# EAGLE design vcf2 (EAGLE 7.2.0)
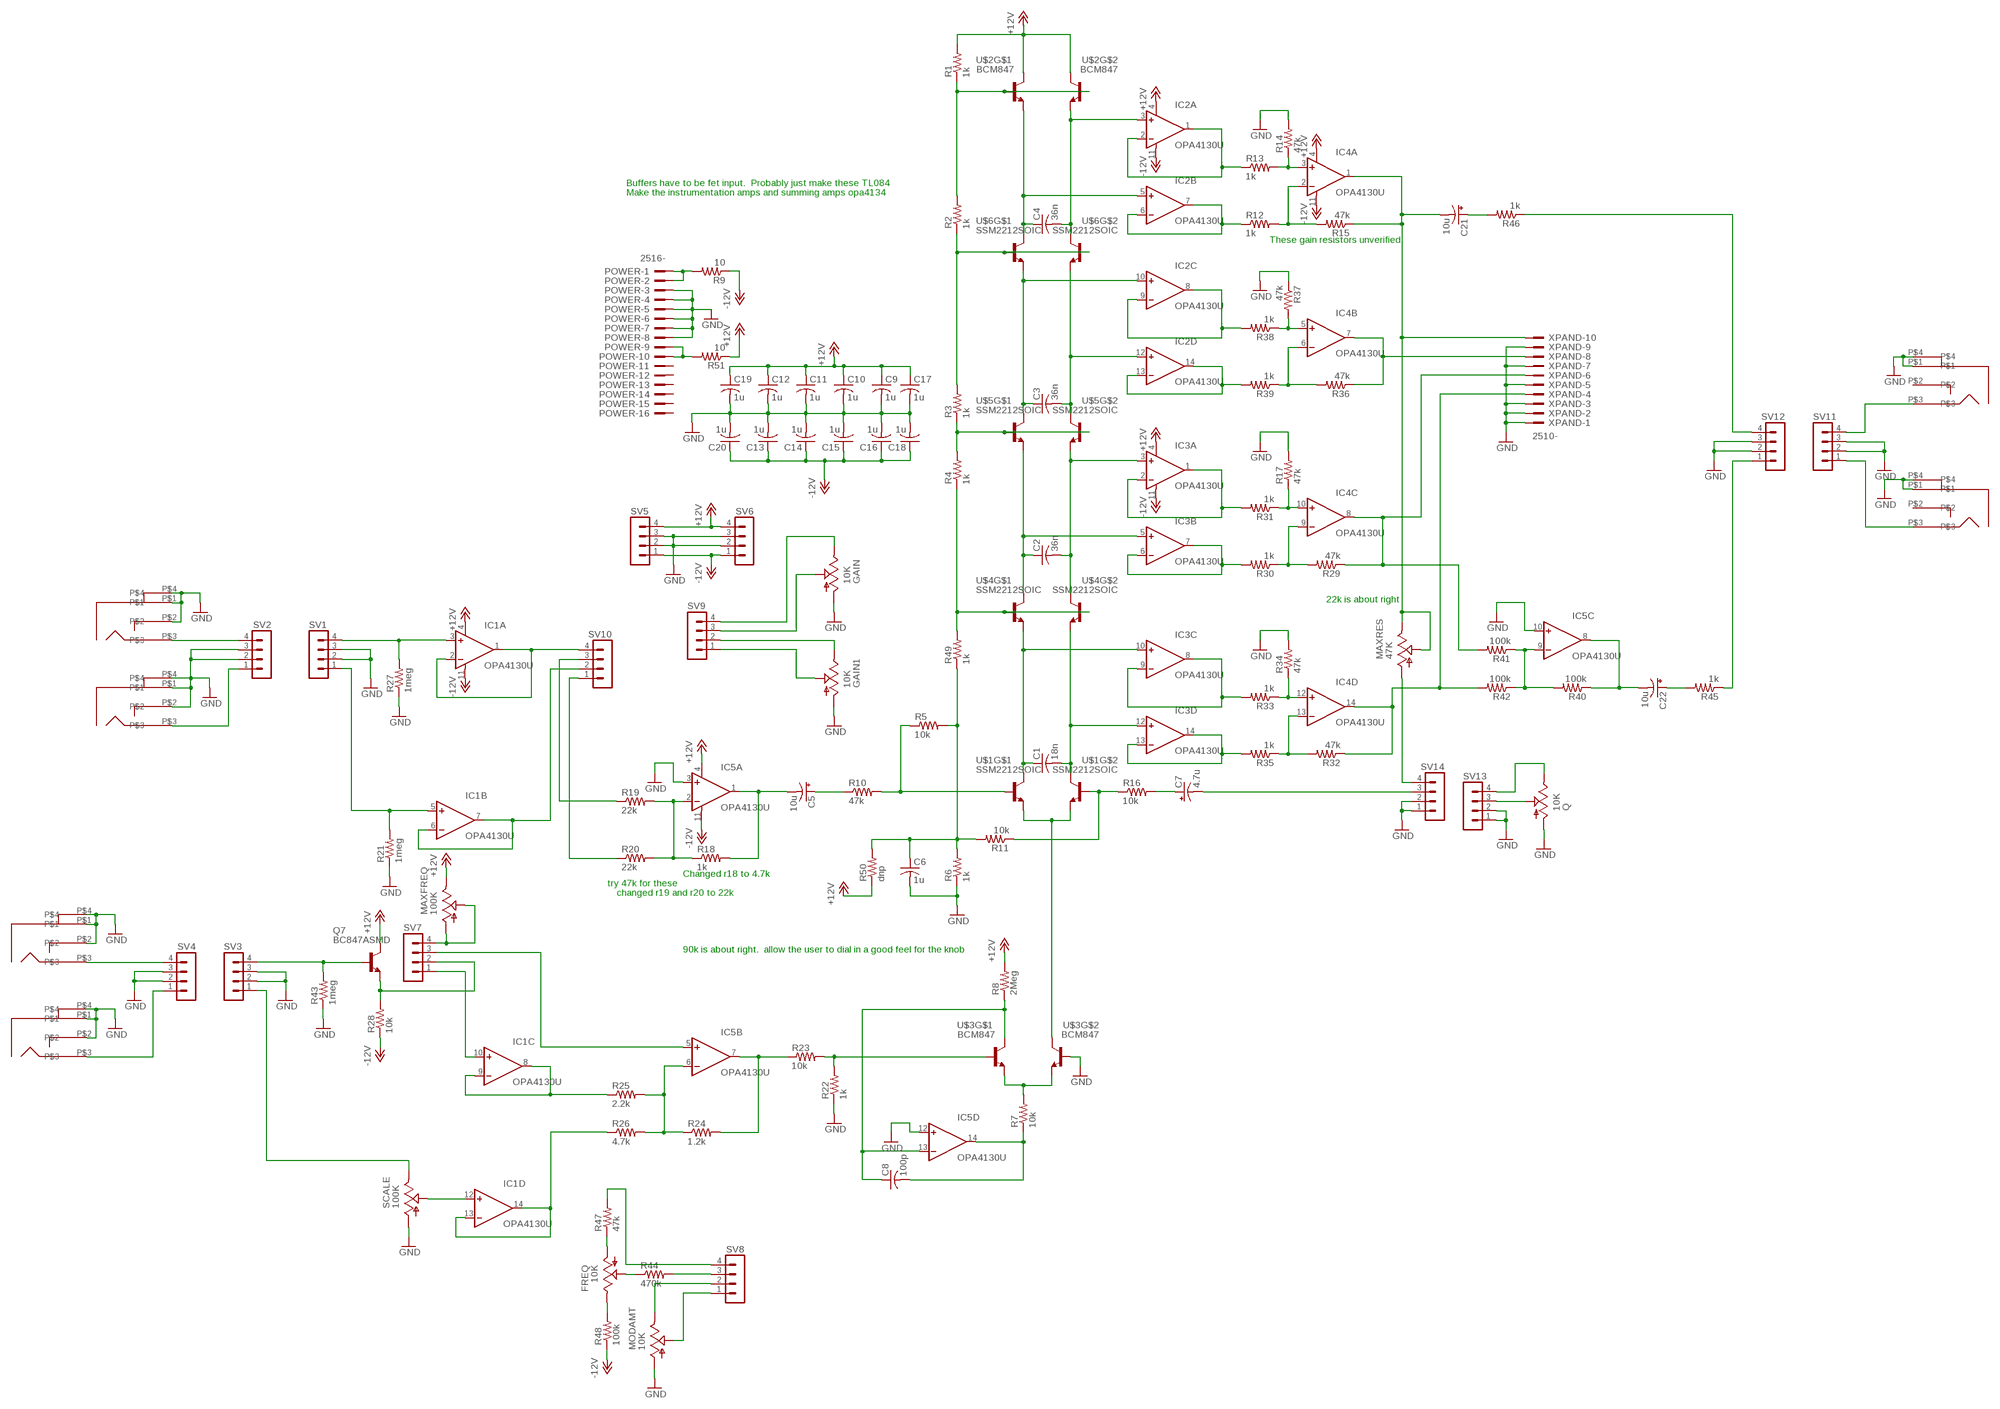
[diagram p0: schematic, sheet 1]

## Parts
AIN  PJ301BM  [PJ301BM]
AIN2  PJ301BM  [PJ301BM]
BP  PJ301BM  [PJ301BM]
C1  18n  C-USC0603  [C0603]
C2  36n  C-USC0603  [C0603]
C3  36n  C-USC0603  [C0603]
C4  36n  C-USC0603  [C0603]
C5  10u  CPOL-USE2.5-6  [E2,5-6]
C6  1u  C-USC0603  [C0603]
C7  4.7u  CPOL-USE2.5-6  [E2,5-6]
C8  100p  C-USC0603  [C0603]
C9  1u  C-USC0603  [C0603]
C10  1u  C-USC0603  [C0603]
C11  1u  C-USC0603  [C0603]
C12  1u  C-USC0603  [C0603]
C13  1u  C-USC0603  [C0603]
C14  1u  C-USC0603  [C0603]
C15  1u  C-USC0603  [C0603]
C16  1u  C-USC0603  [C0603]
C17  1u  C-USC0603  [C0603]
C18  1u  C-USC0603  [C0603]
C19  1u  C-USC0603  [C0603]
C20  1u  C-USC0603  [C0603]
C21  10u  CPOL-USE2.5-6  [E2,5-6]
C22  10u  CPOL-USE2.5-6  [E2,5-6]
FREQ  10K  US-EVUF2J  [EVUFXJ]
GAIN  10K  US-EVUF2J  [EVUFXJ]
GAIN1  10K  US-EVUF2J  [EVUFXJ]
IC1  OPA4130U  [SO14]
IC2  OPA4130U  [SO14]
IC3  OPA4130U  [SO14]
IC4  OPA4130U  [SO14]
IC5  OPA4130U  [SO14]
LP  PJ301BM  [PJ301BM]
MAXFREQ  100K  TRIM_US-S64W  [S64W]
MAXRES  47K  TRIM_US-S64W  [S64W]
MIN  PJ301BM  [PJ301BM]
MODAMT  10K  US-EVUF2J  [EVUFXJ]
POWER  2516-  [PAK100/2500-16]
Q  10K  US-EVUF2J  [EVUFXJ]
Q7  BC847ASMD  [SOT23]
R1  1k  R-US_R0603  [R0603]
R2  1k  R-US_R0603  [R0603]
R3  1k  R-US_R0603  [R0603]
R4  1k  R-US_R0603  [R0603]
R5  10k  R-US_R0603  [R0603]
R6  1k  R-US_R0603  [R0603]
R7  10k  R-US_R0603  [R0603]
R8  2Meg  R-US_R0603  [R0603]
R9  10  R-US_R0603  [R0603]
R10  47k  R-US_R0603  [R0603]
R11  10k  R-US_R0603  [R0603]
R12  1k  R-US_R0603  [R0603]
R13  1k  R-US_R0603  [R0603]
R14  47k  R-US_R0603  [R0603]
R15  47k  R-US_R0603  [R0603]
R16  10k  R-US_R0603  [R0603]
R17  47k  R-US_R0603  [R0603]
R18  1k  R-US_R0603  [R0603]
R19  22k  R-US_R0603  [R0603]
R20  22k  R-US_R0603  [R0603]
R21  1meg  R-US_R0603  [R0603]
R22  1k  R-US_R0603  [R0603]
R23  10k  R-US_R0603  [R0603]
R24  1.2k  R-US_R0603  [R0603]
R25  2.2k  R-US_R0603  [R0603]
R26  4.7k  R-US_R0603  [R0603]
R27  1meg  R-US_R0603  [R0603]
R28  10k  R-US_R0603  [R0603]
R29  47k  R-US_R0603  [R0603]
R30  1k  R-US_R0603  [R0603]
R31  1k  R-US_R0603  [R0603]
R32  47k  R-US_R0603  [R0603]
R33  1k  R-US_R0603  [R0603]
R34  47k  R-US_R0603  [R0603]
R35  1k  R-US_R0603  [R0603]
R36  47k  R-US_R0603  [R0603]
R37  47k  R-US_R0603  [R0603]
R38  1k  R-US_R0603  [R0603]
R39  1k  R-US_R0603  [R0603]
R40  100k  R-US_R0603  [R0603]
R41  100k  R-US_R0603  [R0603]
R42  100k  R-US_R0603  [R0603]
R43  1meg  R-US_R0603  [R0603]
R44  470k  R-US_R0603  [R0603]
R45  1k  R-US_R0603  [R0603]
R46  1k  R-US_R0603  [R0603]
R47  47k  R-US_R0603  [R0603]
R48  100k  R-US_R0603  [R0603]
R49  1k  R-US_R0603  [R0603]
R50  dnp  R-US_R0603  [R0603]
R51  10  R-US_R0603  [R0603]
SCALE  100K  TRIM_US-S64W  [S64W]
SV1  MA04-1  [MA04-1]
SV2  MA04-1  [MA04-1]
SV3  MA04-1  [MA04-1]
SV4  MA04-1  [MA04-1]
SV5  MA04-1  [MA04-1]
SV6  MA04-1  [MA04-1]
SV7  MA04-1  [MA04-1]
SV8  MA04-1  [MA04-1]
SV9  MA04-1  [MA04-1]
SV10  MA04-1  [MA04-1]
SV11  MA04-1  [MA04-1]
SV12  MA04-1  [MA04-1]
SV13  MA04-1  [MA04-1]
SV14  MA04-1  [MA04-1]
U$1  SSM2212SOIC  [SO08]
U$2  BCM847  [SOT457R_PHILIPS]
U$3  BCM847  [SOT457R_PHILIPS]
U$4  SSM2212SOIC  [SO08]
U$5  SSM2212SOIC  [SO08]
U$6  SSM2212SOIC  [SO08]
VPEROCT  PJ301BM  [PJ301BM]
XPAND  2510-  [PAK100/2500-10]

## Nets
+12V: C9.1 C10.1 C11.1 C12.1 C17.1 C19.1 IC1.4(A:V+) IC2.4(A:V+) IC3.4(A:V+) IC4.4(A:V+) IC5.4(A:V+) MAXFREQ.E Q7.3(C) R1.2 R8.2 R50.1 R51.1 SV5.4 SV6.4 U$2.3(C) U$2.6(C)
-12V: C13.1 C14.1 C15.1 C16.1 C18.1 C20.1 IC1.11(A:V-) IC2.11(A:V-) IC3.11(A:V-) IC4.11(A:V-) IC5.11(A:V-) R9.1 R28.1 R48.1 SV5.1 SV6.1
GND: AIN2.P$1 AIN2.P$2 AIN2.P$4 AIN.P$1 AIN.P$2 AIN.P$4 BP.P$1 BP.P$4 C6.2 C9.2 C10.2 C11.2 C12.2 C13.2 C14.2 C15.2 C16.2 C17.2 C18.2 C19.2 C20.2 GAIN1.1(A) GAIN.1(A) IC5.3(A:+IN) IC5.10(C:+IN) IC5.12(D:+IN) LP.P$1 LP.P$4 MIN.P$1 MIN.P$2 MIN.P$4 MODAMT.1(A) POWER.3 POWER.4 POWER.5 POWER.6 POWER.7 POWER.8 Q.1(A) R6.1 R14.2 R17.2 R21.1 R22.1 R27.1 R34.2 R37.1 R43.1 SCALE.A SV1.2 SV1.3 SV2.2 SV2.3 SV3.2 SV3.3 SV4.2 SV4.3 SV5.2 SV5.3 SV6.2 SV6.3 SV11.2 SV11.3 SV12.2 SV12.3 SV13.1 SV13.2 SV14.1 SV14.2 U$3.5(B) VPEROCT.P$1 VPEROCT.P$2 VPEROCT.P$4 XPAND.1 XPAND.2 XPAND.3 XPAND.5 XPAND.7 XPAND.9
N$1: U$1.3(E) U$1.6(E) U$3.3(C)
N$2: C1.1 IC3.10(C:+IN) U$1.1(C) U$4.3(E)
N$3: C2.1 IC3.5(B:+IN) U$4.1(C) U$5.3(E)
N$4: C3.1 IC2.10(C:+IN) U$5.1(C) U$6.3(E)
N$5: C3.2 IC2.12(D:+IN) U$5.8(C) U$6.6(E)
N$6: C2.2 IC3.3(A:+IN) U$4.8(C) U$5.6(E)
N$7: C1.2 IC3.12(D:+IN) U$1.8(C) U$4.6(E)
N$8: C4.2 IC2.3(A:+IN) U$2.4(E) U$6.8(C)
N$9: C4.1 IC2.5(B:+IN) U$2.1(E) U$6.1(C)
N$10: R1.1 R2.2 U$2.2(B) U$2.5(B)
N$11: R2.1 R3.2 U$6.2(B) U$6.7(B)
N$12: R3.1 R4.2 U$5.2(B) U$5.7(B)
N$13: R4.1 R49.2 U$4.2(B) U$4.7(B)
N$14: R5.1 R10.2 U$1.2(B)
N$15: IC5.2(A:-IN) R18.1 R19.2 R20.2
N$16: R7.2 U$3.1(E) U$3.4(E)
N$17: C8.2 IC5.14(D:OUT) R7.1
N$18: Q7.1(B) R43.2 SV3.4
N$19: C8.1 IC5.13(D:-IN) R8.1 U$3.6(C)
N$20: C5.- IC5.1(A:OUT) R18.2
N$21: C5.+ R10.1
N$22: R11.1 R16.1 U$1.7(B)
N$23: IC2.1(A:OUT) IC2.2(A:-IN) R13.1
N$24: IC5.5(B:+IN) SV7.3
N$25: IC4.2(A:-IN) R12.2 R15.2
N$26: IC4.3(A:+IN) R13.2 R14.1
N$27: C21.- IC4.1(A:OUT) MAXRES.E MAXRES.S R15.1 XPAND.10
N$28: IC2.8(C:OUT) IC2.9(C:-IN) R38.2
N$29: IC1.8(C:OUT) IC1.9(C:-IN) R25.1
N$30: IC1.6(B:-IN) IC1.7(B:OUT) SV10.2
N$31: C7.+ R16.2
N$32: MAXRES.A SV14.4
N$33: Q7.2(E) R28.2 SV7.2
N$34: R22.2 R23.2 U$3.2(B)
N$35: IC2.6(B:-IN) IC2.7(B:OUT) R12.1
N$36: IC5.6(B:-IN) R24.1 R25.2 R26.2
N$37: IC3.1(A:OUT) IC3.2(A:-IN) R31.2
N$38: IC1.13(D:-IN) IC1.14(D:OUT) R26.1
N$39: IC3.8(C:OUT) IC3.9(C:-IN) R33.2
N$40: SCALE.E SV3.1
N$41: IC1.12(D:+IN) SCALE.S
N$42: IC2.13(D:-IN) IC2.14(D:OUT) R39.2
N$43: R19.1 SV10.3
N$44: IC3.6(B:-IN) IC3.7(B:OUT) R30.2
N$45: IC4.10(C:+IN) R17.1 R31.1
N$46: IC4.9(C:-IN) R29.2 R30.1
N$47: IC4.8(C:OUT) R29.1 R41.2 XPAND.6
N$48: IC3.13(D:-IN) IC3.14(D:OUT) R35.2
N$49: R45.1 SV12.1
N$50: MODAMT.2(S) SV8.1
N$51: IC4.13(D:-IN) R32.2 R35.1
N$52: IC4.14(D:OUT) R32.1 R42.2 XPAND.4
N$53: IC5.7(B:OUT) R23.1 R24.2
N$54: IC4.12(D:+IN) R33.1 R34.1
N$55: IC4.5(B:+IN) R37.2 R38.1
N$56: IC4.6(B:-IN) R36.2 R39.1
N$57: GAIN1.3(E) SV9.2
N$58: IC4.7(B:OUT) R36.1 XPAND.8
N$59: IC5.9(C:-IN) R40.2 R41.1 R42.1
N$60: FREQ.1(A) R47.1
N$61: C22.- IC5.8(C:OUT) R40.1
N$62: IC1.3(A:+IN) R27.2 SV1.4
N$63: C21.+ R46.2
N$64: R46.1 SV12.4
N$65: FREQ.2(S) R44.1
N$66: FREQ.3(E) R48.2
N$67: IC1.1(A:OUT) IC1.2(A:-IN) SV10.4
N$68: C6.1 R5.2 R6.2 R11.2 R49.1 R50.2
N$69: IC1.5(B:+IN) R21.2 SV1.1
N$70: C22.+ R45.2
N$71: POWER.9 POWER.10 R51.2
N$72: POWER.1 POWER.2 R9.2
N$73: MAXFREQ.A MAXFREQ.S SV7.4
N$74: C7.- SV14.3
N$75: AIN.P$3 SV2.4
N$76: AIN2.P$3 SV2.1
N$77: MIN.P$3 SV4.4
N$78: SV4.1 VPEROCT.P$3
N$79: MODAMT.3(E) SV8.2
N$80: R44.2 SV8.3
N$81: IC1.10(C:+IN) SV7.1
N$82: BP.P$3 SV11.1
N$83: LP.P$3 SV11.4
N$84: R20.1 SV10.1
N$85: GAIN.3(E) SV9.4
N$86: GAIN.2(S) SV9.3
N$87: Q.2(S) SV13.3
N$88: GAIN1.2(S) SV9.1
N$89: Q.3(E) SV13.4
N$90: R47.2 SV8.4
Unconnected: BP.P$2 LP.P$2 POWER.11 POWER.12 POWER.13 POWER.14 POWER.15 POWER.16

## Notes on the sheet
- Buffers have to be fet input.  Probably just make these TL084
- Make the instrumentation amps and summing amps opa4134
- These gain resistors unverified
- 22k is about right
- Changed r18 to 4.7k
- try 47k for these
- changed r19 and r20 to 22k
- 90k is about right.  allow the user to dial in a good feel for the knob

## Library data of the parts
AIN AIN2 BP LP MIN VPEROCT = dan:PJ301BM
C1-C4 C6 C8-C20 = dan:C-US: CAPACITOR, American symbol
C5 C7 C21 C22 = dan:CPOL-US: POLARIZED CAPACITOR, American symbol
FREQ GAIN GAIN1 MODAMT Q = dan:US-EVU: 9 mm Square Rotary Potentiometers Source: Panasonic
IC1-IC5 = dan:OPA4130: Low Power, Precision FET-Input Operational Amplifiers; MF: TEXAS INSTRUMENTS; MPN: OPA4130UA; OC_FARNELL: 1648707; OC_NEWARK: 80K8080
MAXFREQ MAXRES SCALE = dan:TRIM_US-: POTENTIOMETER
POWER = dan:2516-: 3M (TM) Pak 100 4-Wall Header Source: 3M; OC_FARNELL: unknown; OC_NEWARK: unknown
Q7 = dan:BC847*: NPN Transistor
R1-R51 = dan:R-US_: RESISTOR, American symbol
SV1-SV14 = dan:MA04-1: PIN HEADER; OC_FARNELL: unknown; OC_NEWARK: unknown
U$1 U$4-U$6 = dan:SSM2212
U$2 U$3 = dan:BCM847
XPAND = dan:2510-: 3M (TM) Pak 100 4-Wall Header Source: 3M; MF: 3M; MPN: 2510-6002UB; OC_FARNELL: 9838244; OC_NEWARK: 46F4725

## Board
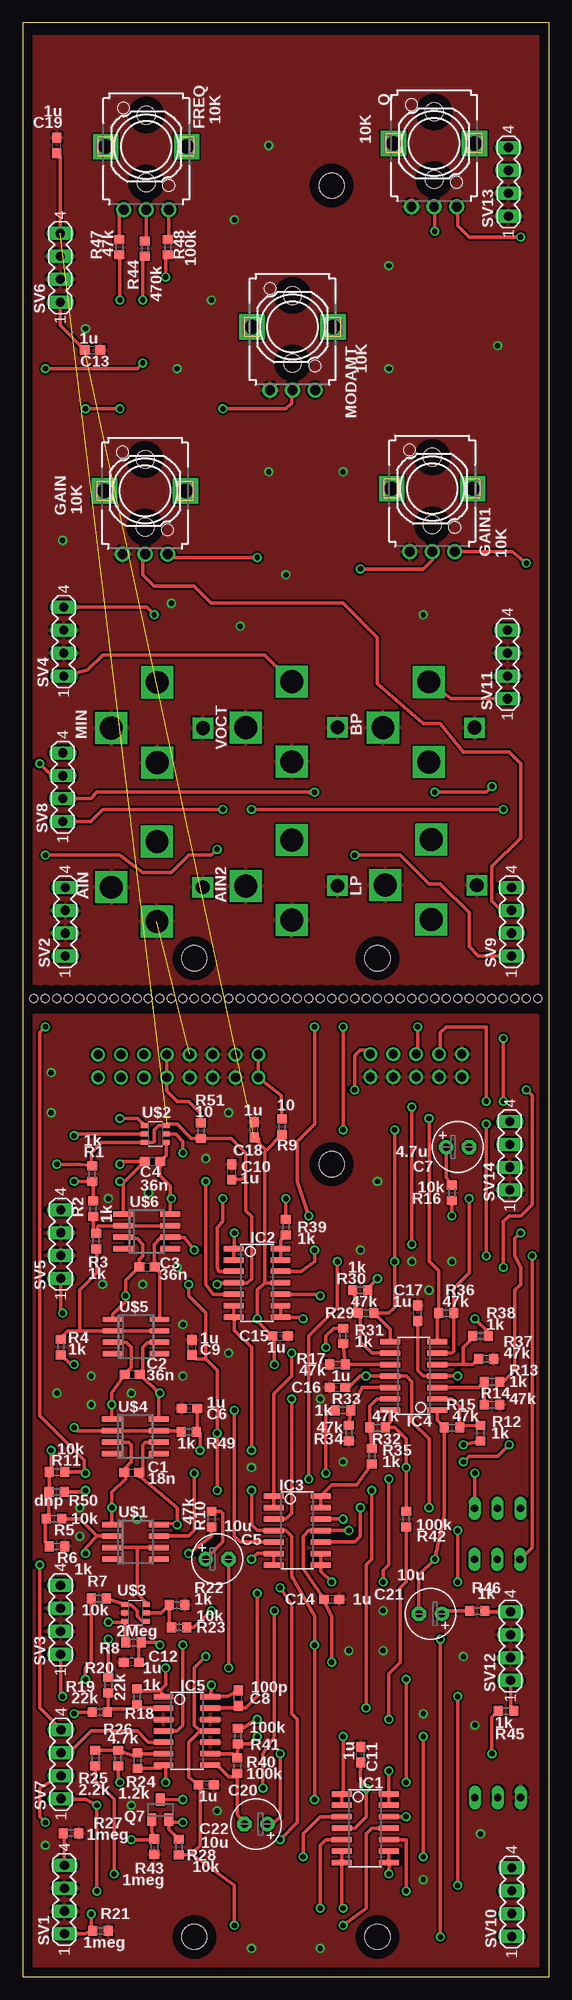
[diagram p1: board, top side]
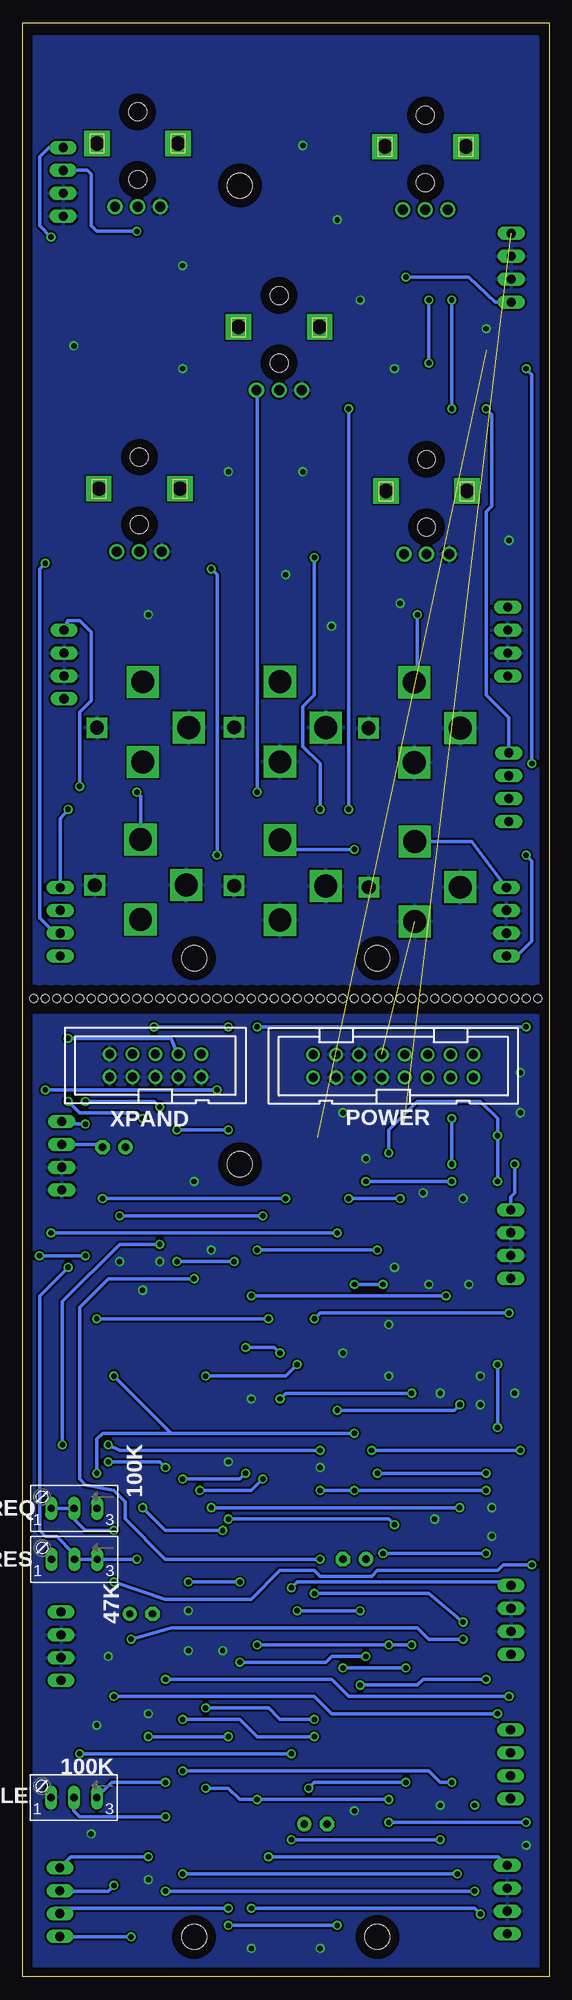
[diagram p2: board, bottom side, seen from below]

Size 58.4 x 216.84 mm. Coordinates in mm from the lower left corner, seen from the top.
Outline: 0,0 58.4,0 58.4,216.84 0,216.84 0,0
Copper layers (1*16): Top 0.035mm / dielectric 1.5mm / Bottom 0.035mm
Design rules "default *": minimum track width 10mil, minimum drill 20mil, track to track 8mil, track to pad 8mil, pad to pad 8mil, via to via 8mil, smd to smd 8mil, copper to edge 40mil, drill to drill 8mil, minimum pad ring 10mil, minimum via ring 8mil, stop-mask expansion 4mil, vias tented up to drill 0mil, thermal gap 10mil
Holes 2.8 mm at 39.37,4.45 19.05,4.45 34.29,90.17 39.37,113.03 19.05,113.03 34.29,198.75
Holes 0.9 mm at 1.27,108.58 2.54,108.58 3.81,108.58 5.08,108.58 6.35,108.58 7.62,108.58 8.89,108.58 10.16,108.58 11.43,108.58 12.7,108.58 13.97,108.58 15.24,108.58 16.51,108.58 17.78,108.58 19.05,108.58 20.32,108.58 21.59,108.58 22.86,108.58 24.13,108.58 25.4,108.58 26.67,108.58 27.94,108.58 29.21,108.58 30.48,108.58 31.75,108.58 33.02,108.58 34.29,108.58 35.56,108.58 36.83,108.58 38.1,108.58 39.37,108.58 40.64,108.58 41.91,108.58 43.18,108.58 44.45,108.58 45.72,108.58 46.99,108.58 48.26,108.58 49.53,108.58 50.8,108.58 52.07,108.58 53.34,108.58 54.61,108.58 55.88,108.58 57.15,108.58

### Footprints (pad centres in the part's own frame; a part is rotated, then mirrored left to right if it is on the bottom)
PJ301BM = drill 1.524 square: P$1 5.08,0 | drill 2.54 square: P$2 0,-3.81; P$3 0,5.08; P$4 -5.08,0
C0603 = smd 1.1 x 1: 1 -0.85,0; 2 0.85,0
E2,5-6 = drill 0.813 pad 1.6: + -1.27,0 | drill 0.813 pad 1.6 octagon: - 1.27,0
EVUFXJ = drill 1.1 pad 1.676: 1 -2.5,-7; 2 0,-7; 3 2.5,-7 | drill 1.6 pad 2.8 square: M1 4.5,0; M2 -4.5,0 | hole 2: 0,3.5; 0,-4
SO14 = smd 0.61 x 2.21: 1 -3.81,-2.603; 2 -2.54,-2.603; 3 -1.27,-2.603; 4 0,-2.603; 5 1.27,-2.603; 6 2.54,-2.603; 7 3.81,-2.603; 8 3.81,2.603; 9 2.54,2.603; 10 1.27,2.603; 11 0,2.603; 12 -1.27,2.603; 13 -2.54,2.603; 14 -3.81,2.603
S64W = drill 0.813 long: A 2.54,1.27; E -2.54,1.27; S 0,1.27
PAK100/2500-16 = drill 1 pad 1.422: 1 -8.89,-1.27; 2 -8.89,1.27; 3 -6.35,-1.27; 4 -6.35,1.27; 5 -3.81,-1.27; 6 -3.81,1.27; 7 -1.27,-1.27; 8 -1.27,1.27; 9 1.27,-1.27; 10 1.27,1.27; 11 3.81,-1.27; 12 3.81,1.27; 13 6.35,-1.27; 14 6.35,1.27; 15 8.89,-1.27; 16 8.89,1.27
SOT23 = smd 1 x 1.4: 1 -0.95,-1.1; 2 0.95,-1.1; 3 0,1.1
R0603 = smd 1 x 1.1: 1 -0.85,0; 2 0.85,0
MA04-1 = drill 1.016 long: 1 -3.81,0; 2 -1.27,0; 3 1.27,0; 4 3.81,0
SO08 = smd 0.6 x 2.2: 1 -1.905,-2.6; 2 -0.635,-2.6; 3 0.635,-2.6; 4 1.905,-2.6; 5 1.905,2.6; 6 0.635,2.6; 7 -0.635,2.6; 8 -1.905,2.6
SOT457R_PHILIPS = smd 0.55 x 0.8: 1 -0.95,-1.2; 2 0,-1.2; 3 0.95,-1.2; 4 0.95,1.2; 5 0,1.2; 6 -0.95,1.2
PAK100/2500-10 = drill 1 pad 1.422: 1 -5.08,-1.27; 2 -5.08,1.27; 3 -2.54,-1.27; 4 -2.54,1.27; 5 0,-1.27; 6 0,1.27; 7 2.54,-1.27; 8 2.54,1.27; 9 5.08,-1.27; 10 5.08,1.27

### Placement (x,y rotation side)
AIN  14.91,120.9 0 top
AIN2  29.84,121.06 0 top
BP  45.06,138.61 0 top
C1  12.12,55.96 0 top
C2  12.17,66.88 0 top
C3  13.79,78.77 0 top
C4  14.4,90.47 0 top
C5  21.59,46.35 0 top
C6  18.52,63.09 180 top
C7  48.26,92.08 0 top
C8  23.9,30.94 90 top
C9  18.8,69.85 90 top
C10  23.22,89.31 90 top
C11  37.49,24.69 90 top
C12  12.06,34.92 180 top
C13  7.77,180.52 0 top
C14  34.29,41.91 0 top
C15  28.57,71.12 0 top
C16  34.92,65.41 180 top
C17  43.81,73.66 90 top
C18  25.68,94.01 90 top
C19  3.81,203.2 90 top
C20  20.37,21.34 0 top
C21  45.24,40.28 180 top
C22  25.88,16.97 180 top
FREQ  13.72,203.07 0 top
GAIN  13.59,164.87 0 top
GAIN1  45.44,165.13 0 top
IC1  38,16.51 270 top
IC2  26.01,77.01 270 top
IC3  30.48,49.53 270 top
IC4  43.38,66.67 90 top
IC5  18.24,27.3 270 top
LP  45.31,121.13 0 top
MAXFREQ  52.68,53.26 180 bottom
MAXRES  52.65,47.6 180 bottom
MIN  14.94,138.56 0 top
MODAMT  29.95,183.06 0 top
POWER  17.27,101.07 0 bottom
Q  45.64,203.43 0 top
Q7  15.29,18.57 0 top
R1  7.72,89.1 90 top
R2  7.82,85.24 90 top
R3  8.18,81.64 90 top
R4  4.24,69.88 90 top
R5  3.48,50.85 180 top
R6  3.84,47.78 180 top
R7  8.46,41.99 0 top
R8  12.32,37.11 0 top
R9  28.78,94.34 90 top
R10  20.95,50.8 270 top
R11  3.84,56.03 180 top
R12  50.8,60.33 90 top
R13  52.07,66.04 180 top
R14  52.07,63.5 0 top
R15  47.62,60.96 0 top
R16  47.62,87 90 top
R17  34.92,67.94 180 top
R18  12.7,31.11 90 top
R19  8.56,29.39 0 top
R20  9.53,32.38 270 top
R21  8.64,5.11 180 top
R22  17.14,41.27 180 top
R23  17.37,38.79 180 top
R24  12.75,24 270 top
R25  8.08,24.28 90 top
R26  10.62,24.28 90 top
R27  5.38,15.95 180 top
R28  17.35,14.43 90 top
R29  38.1,73.66 180 top
R30  37.47,76.2 0 top
R31  35.56,71.12 90 top
R32  39.37,60.96 180 top
R33  35.56,62.87 180 top
R34  36.2,60.33 270 top
R35  38.73,57.78 270 top
R36  46.99,73.66 0 top
R37  51.44,68.58 180 top
R38  50.8,71.12 0 top
R39  29.21,83.19 270 top
R40  23.83,23.44 90 top
R41  23.88,26.72 90 top
R42  42.55,50.8 90 top
R43  14.63,14.45 90 top
R44  13.56,191.74 270 top
R45  53.62,29.51 180 top
R46  50.44,40.61 180 top
R47  10.74,191.92 270 top
R48  16.1,191.92 90 top
R49  18.44,60.48 180 top
R50  3.78,53.82 180 top
R51  19.79,93.88 90 top
SCALE  52.7,21.18 180 bottom
SV1  4.65,8.59 90 top
SV2  4.72,117.07 90 top
SV3  4.22,39.62 90 top
SV4  4.57,148.16 90 top
SV5  4.24,81.31 90 top
SV6  4.19,189.64 90 top
SV7  4.27,23.6 90 top
SV8  4.47,132 90 top
SV9  54.23,117.07 90 top
SV10  54.25,8.31 90 top
SV11  53.8,145.62 90 top
SV12  54.13,36.7 90 top
SV13  53.9,199.16 90 top
SV14  54.05,91.11 90 top
U$1  12.52,48.29 270 top
U$2  14.73,93.52 270 top
U$3  12.52,40.39 90 top
U$4  12.5,59.97 270 top
U$5  12.6,71.04 270 top
U$6  13.77,82.7 270 top
VPEROCT  29.84,138.63 0 top
XPAND  43.66,101.12 0 bottom

### Tracks (layer width: path | path; a pad name or v marks a point on that pad's centre or on a via)
+12V  (via drill 0.6)  (1 unrouted)
  Top 0.406: v3.81,90.17 6.35,90.17 7.62,90.06 | 7.62,90.06 7.62,91.44 8.75,92.57 U$2.3 14.47,92.57 14.61,92.71 14.61,93.98 15.1,94.47 U$2.6 16.07,94.61 17.14,94.61 18.73,93.03 R51.1 23.18,93.03 24.77,91.44 24.77,88.9 | 7.62,90.06 R1.2 | R50.1 6.5,53.82 v6.99,53.98 | 24.77,88.9 24.77,85 25.4,84.37 25.4,77.47 24.94,77.01 IC2.4 21.77,77.01 v21.59,76.83 | C10.1 24.32,88.46 24.77,88.9 | IC1.4 36.83,16.51 38.1,17.78 v38.1,20.95 37.47,21.96 C11.1 | Q7.3 15.22,19.67 v17.78,19.68 | v25.4,53.98 25.4,50.16 26.04,49.53 IC3.4 29.21,49.53 29.84,48.9 29.84,44.45 32.38,40.01 v32.38,36.83 v32.38,19.68 | IC5.4 17.14,27.3 17.78,27.94 v17.78,36.83 | C17.1 43.81,67.31 44.45,66.67 IC4.4 v48.26,66.67 | v18.41,76.83 18.41,75.56 20.32,73.66 20.32,68.58 | v15.24,36.83 14.96,37.11 R8.2 12.91,36.85 C12.1 | 20.32,68.58 21.59,67.31 v21.59,60.33 v21.59,53.98 | 20.32,68.58 19.22,68.58 C9.1 | v50.16,55.88 50.16,52.65 MAXFREQ.E | SV6.4 4.19,201.97 C19.1
  Bottom 0.406: v6.99,53.98 v21.59,53.98 v25.4,53.98 | v17.78,19.68 v32.38,19.68 34.29,19.68 35.56,20.95 v38.1,20.95 | v32.38,36.83 v17.78,36.83 v15.24,36.83 | v18.41,76.83 v21.59,76.83 | SV5.4 4.24,86.56 3.81,87 v3.81,90.17 | v21.59,60.33 41.91,60.33 | 41.91,60.33 v48.26,66.67 | 41.91,60.33 49.53,60.33 50.16,59.69 v50.16,55.88
-12V  (via drill 0.6)  (1 unrouted)
  Top 0.406: IC2.11 26.85,77.01 | 26.85,77.01 26.04,76.2 v26.04,73.03 26.04,72.81 C15.1 27.94,70.91 v27.94,67.94 | C18.1 26.21,93.05 26.21,92.53 27.02,91.73 | 19.68,27.3 18.41,26.04 18.41,22.14 C20.1 19.68,21.17 19.68,14.61 18.73,13.65 | 26.85,77.01 26.85,91.56 27.02,91.73 | 27.02,91.73 R9.1 | SV5.1 4.24,73.86 v4.45,73.66 | R28.1 18.66,13.58 18.73,13.65 | IC1.11 38.73,16.51 38.1,15.88 38.1,7.62 v35.56,5.71 | v23.5,5.71 23.5,10.16 18.73,13.65 | IC5.11 19.68,27.3 | 19.68,27.3 19.05,27.94 19.05,34.29 v20.32,35.56 | v34.29,34.92 34.29,40.01 33.66,41.27 33.66,41.7 C14.1 31.11,45.3 31.11,48.9 31.75,49.53 IC3.11 v36.2,49.53 | C16.1 36.2,65.41 37.47,66.67 v38.1,66.67 IC4.11 42.55,66.67 43.18,66.04 43.18,61.59 45.09,59.69 v45.09,52.07 | v15.88,188.59 15.88,190.84 R48.1 | SV6.1 4.19,183.25 C13.1
  Bottom 0.406: v4.45,73.66 25.4,73.66 v26.04,73.03 | v38.1,66.67 29.21,66.67 v27.94,67.94 | v36.2,49.53 42.55,49.53 v45.09,52.07 | v34.29,34.92 24.77,34.92 24.13,35.56 v20.32,35.56 | SV6.1 5.94,185.83 8.89,188.59 v15.88,188.59 | v23.5,5.71 v35.56,5.71
GND  (via drill 0.6)  (1 unrouted)
  other vias: 13.97,87 9.53,86.36 13.34,76.83 12.06,64.77 12.7,50.8 8.89,76.83 20.32,90.81 22.86,95.89 3.17,95.89 3.17,100.33 17.14,78.74 45.09,76.2 43.18,79.38 21.59,18.41 12.06,19.05 44.45,29.21 44.45,10.79 50.8,15.88 50.16,27.94 48.9,35.56 40.01,36.2 36.2,36.2 40.01,40.64 33.02,3.17 25.4,3.17 2.54,14.61 33.02,64.14 35.56,57.15 22.86,69.22 17.78,66.67 17.78,72.39 7.62,66.67 3.81,64.77 7.62,63.5 6.35,48.9 6.35,52.07 25.4,56.52 47.62,79.38 39.37,88.27 37.47,80.64 35.56,167 27.3,167 29.21,155.57 16.51,152.4 17.14,178.44 40.64,178.44 52.7,180.97 44.45,151.13 24.13,149.86 4.45,159.38 6.99,182.88 20.95,186.06 40.64,189.87 23.5,194.94 27.3,203.2
  pour Top: 1.27,106.68 57.15,106.68 57.15,0.64 1.27,0.64
  pour Top: 57.15,215.26 1.27,215.26 1.27,109.86 57.15,109.86
  pour Bottom: 1.27,106.68 57.15,106.68 57.15,0.64 1.27,0.64
  pour Bottom: 1.27,215.26 57.15,215.26 57.15,109.86 1.27,109.86
N$1
  Top 0.406: U$1.3 12.7,47.65 | 12.7,47.65 U$1.6 | U$3.3 13.72,41.52 12.7,42.55 12.7,47.65
N$2  (via drill 0.6)
  Top 0.406: U$4.3 11.79,59.33 12.06,59.05 12.06,57.15 11.43,56.52 11.43,55.79 | 11.43,55.79 11.43,55.48 | 11.43,55.48 C1.1 11.43,55.79 | U$1.1 v9.92,52.07 9.92,53.74 11.43,55.24 11.43,55.48 | IC3.10 36.83,48.26 37.47,48.9 v37.47,52.07
  Bottom 0.406: v37.47,52.07 v9.92,52.07
N$3  (via drill 0.6)
  Top 0.406: U$4.1 v9.9,63.5 9.9,64.82 C2.1 12.06,67.63 12.06,69.85 11.51,70.41 U$5.3 | IC3.5 24.13,48.26 23.5,48.9 v23.5,62.87
  Bottom 0.406: v23.5,62.87 10.53,62.87 v9.9,63.5
N$4  (via drill 0.6)
  Top 0.406: U$5.1 10,73.5 11.43,74.93 v11.43,75.56 11.43,77.25 C3.1 12.94,79.62 13.34,80.01 13.34,81.28 12.7,81.92 11.32,81.92 U$6.3 | IC2.10 32.84,75.74 v33.02,75.56
  Bottom 0.406: v33.02,75.56 v11.43,75.56
N$5  (via drill 0.6)
  Top 0.406: U$5.8 15.24,72.99 15.24,78.11 14.64,78.7 C3.2 14.64,79.41 14.61,79.38 14.61,81.28 15.24,81.92 16.21,81.92 U$6.6 17.93,82.07 v19.05,80.64 | v32.38,80.64 32.38,79.38 30.94,78.28 IC2.12
  Bottom 0.406: v19.05,80.64 v32.38,80.64
N$6  (via drill 0.6)
  Top 0.406: U$5.6 13.89,70.41 13.34,69.85 13.34,67.2 C2.2 15.1,64.8 U$4.8 15.1,64.63 v15.24,64.77 | v29.84,64.14 29.84,51.44 29.21,50.8 IC3.3
  Bottom 0.406: v15.24,64.77 29.21,64.77 v29.84,64.14
N$7  (via drill 0.6)
  Top 0.406: 12.97,55.61 12.97,55.51 13.34,55.88 13.34,59.05 13.61,59.33 U$4.6 | C1.2 12.97,55.61 | 12.97,55.61 17.14,52.07 17.14,50.31 | 17.14,50.31 U$1.8 | 17.14,50.31 v17.14,50.16 | v35.56,50.8 IC3.12
  Bottom 0.406: v17.14,50.16 17.78,50.8 v35.56,50.8
N$8  (via drill 0.6)
  Top 0.406: U$2.4 15.93,91.16 C4.2 15.24,89.19 15.24,88.9 16.37,87.77 U$6.8 16.37,86.22 v16.51,86.36 | IC2.3 21.77,78.28 21.59,78.74 21.59,83.19 22.23,83.82 v22.23,86.36
  Bottom 0.406: v16.51,86.36 v22.23,86.36
N$9  (via drill 0.6)
  Top 0.406: v10.79,88.27 11.17,87.89 U$6.1 11.17,88.09 C4.1 11.1,90.47 v10.79,90.17 | v20.32,88.27 20.32,76.83 21.13,75.74 IC2.5 | v10.79,95.25 12.76,95.25 U$2.1
  Bottom 0.406: v10.79,88.27 v20.32,88.27 | v10.79,90.17 v10.79,95.25
N$10  (via drill 0.6)
  Top 0.406: R2.2 7.82,87.52 R1.1 7.71,88.27 v5.71,88.27 | U$2.2 5.89,93.52 v5.71,93.34 | U$2.5 16.97,93.52 17.78,92.71 v17.78,91.44
  Bottom 0.406: v5.71,88.27 v5.71,93.34 5.71,95.25 7.62,97.16 14.61,97.16 17.78,93.98 v17.78,91.44
N$11
  Top 0.406: U$6.7 U$6.2 8.4,83.34 R3.2 7.82,82.77 R2.1
N$12
  Top 0.406: 6.35,71.68 U$5.2 U$5.7 | R4.2 4.45,70.93 4.45,71.12 5,71.68 6.35,71.68 | 6.35,71.68 6.35,76.2 8.26,78.11 8.26,80.71 R3.1
N$13  (via drill 0.6)
  Top 0.406: v5.71,60.96 6.07,60.6 U$4.2 U$4.7 17.46,60.6 R49.2 | v5.71,67.94 5.32,67.94 R4.1
  Bottom 0.406: v5.71,60.96 v5.71,67.94
N$14  (via drill 0.6)
  Top 0.406: 8.28,48.92 8.23,48.92 | 8.26,48.9 8.23,48.92 | 8.23,48.92 6.35,50.8 4.38,50.8 R5.1 | U$1.2 8.28,48.92 | 8.28,48.92 6.99,47.62 v6.99,46.99 | v18.41,46.99 20.95,48.9 R10.2
  Bottom 0.406: v18.41,46.99 v6.99,46.99
N$15
  Top 0.406: IC5.2 13.12,29.84 R18.1 12.16,29.73 9.53,29.73 | R19.2 9.53,29.73 | R20.2 9.53,29.73
N$16
  Top 0.406: R7.2 11.31,41.35 U$3.4 11.38,41.27 12.06,41.27 12.7,40.64 12.7,40.01 13.27,39.44 U$3.1
N$17  (via drill 0.6)
  Top 0.406: v6.99,33.02 6.97,33.67 6.97,34.28 7.62,34.92 7.62,41.97 R7.1 | v20.95,32.38 20.95,31.86 IC5.14 22.78,31.15 C8.2
  Bottom 0.406: v20.95,32.38 14.61,32.38 13.97,33.02 v6.99,33.02
N$18  (via drill 0.6)
  Top 0.406: Q7.1 14.34,16.23 R43.2 14.57,15.24 v12.06,15.24 | v28.57,15.24 30.48,17.14 30.48,28.57 29.84,29.21 29.84,41.27 v28.57,43.18
  Bottom 0.406: SV3.4 4.19,43.43 4.45,43.81 27.94,43.81 v28.57,43.18 | v28.57,15.24 v12.06,15.24
N$19  (via drill 0.6)
  Top 0.406: U$3.6 11.32,39.37 | 11.32,39.37 11.32,37.12 R8.1 | IC5.13 23.66,29.84 C8.1 24.14,29.84 24.77,29.84 26.04,31.11 v26.04,42.55 | v9.53,39.37 11.32,39.37
  Bottom 0.406: v9.53,39.37 13.34,42.55 v26.04,42.55
N$20  (via drill 0.6)
  Top 0.406: IC5.1 15.63,31.36 15.24,31.75 | 15.24,31.75 12.91,31.75 R18.2 | C5.- v22.86,34.29 | v15.88,34.29 15.88,32.38 15.24,31.75
  Bottom 0.406: v22.86,34.29 v15.88,34.29
N$21
  Top 0.406: R10.1 22.01,51.65 22.23,51.44 22.23,48.26 C5.+
N$22  (via drill 0.6)
  Top 0.406: v19.05,55.88 19.05,49.53 18.44,48.92 U$1.7 | 6.83,56.03 6.83,57.3 1.91,62.23 1.91,104.78 v2.54,105.41 | v32.38,105.41 32.38,94.61 30.48,92.71 30.48,88.27 v31.75,84.45 | v47.62,84.45 R16.1 | R11.1 6.83,56.03 | 6.83,56.03 v6.99,55.88
  Bottom 0.406: v6.99,55.88 v19.05,55.88 | v2.54,105.41 v32.38,105.41 | v31.75,84.45 v47.62,84.45
N$23  (via drill 0.6)
  Top 0.406: IC2.2 IC2.1 23.5,80.91 v23.5,82.55 | R13.1 53.34,66.04 54.61,67.31 54.61,76.2 55.24,76.83 55.24,78.74 54.61,80.01 54.61,81.92 v55.24,82.55
  Bottom 0.406: v55.24,82.55 v23.5,82.55
N$24
  Top 0.406: IC5.5 13.97,26.04 12.7,27.3 7.62,27.3 5.08,24.77 SV7.3
N$25
  Top 0.406: 48.48,61.16 48.48,63.28 47.62,64.14 IC4.2 | R15.2 48.48,61.16 | 48.48,61.16 R12.2
N$26
  Top 0.406: R14.1 R13.2 50.59,65.41 IC4.3
N$27  (via drill 0.6)
  Top 0.406: IC4.1 45.99,61.75 R15.1 46.77,51.22 v45.72,46.35 43.97,44.6 C21.- | v53.34,78.74 53.34,83.82 53.98,84.45 55.24,84.45 56.52,85.72 56.52,97.79 v55.88,98.42 | v36.83,98.42 36.83,102.23 37.47,102.87 38.1,102.87 XPAND.10
  Bottom 0.406: v45.72,46.35 50.09,46.35 MAXRES.E | MAXRES.E 52.07,46.33 | 52.07,46.33 MAXRES.S | v53.34,78.74 56.52,75.56 56.52,49.53 55.88,48.9 54.61,48.9 52.7,46.97 52.07,46.33 | v55.88,98.42 v36.83,98.42 | 50.16,46.38 MAXRES.E
N$28  (via drill 0.6)
  Top 0.406: IC2.9 IC2.8 30.94,73.2 v31.11,73.03 | R38.2 51.65,71.54 v50.16,73.03
  Bottom 0.406: v31.11,73.03 v50.16,73.03
N$29  (via drill 0.6)
  Top 0.406: IC1.9 IC1.8 41.27,12.66 40.68,12.66 v40.64,11.43 | R25.1 8.08,21.77 10.16,19.68 v10.16,11.43
  Bottom 0.406: v10.16,11.43 v40.64,11.43
N$30  (via drill 0.6)
  Top 0.406: IC1.6 IC1.7 35.4,7.79 v35.56,7.62
  Bottom 0.406: SV10.2 54.84,7.62 v35.56,7.62
N$31
  Top 0.406: C7.+ 46.99,88.69 R16.2
N$32  (via drill 0.6)
  Top 0.406: MAXRES.A 55.22,46.33 56.52,47.62 v56.52,80.01 | v51.44,80.01 v51.44,94.61
  Bottom 0.406: v56.52,80.01 v51.44,80.01 | v51.44,94.61 54.38,94.61 SV14.4
N$33  (via drill 0.6)
  Top 0.406: R28.2 16.24,16.39 Q7.2 16.56,17.14 v17.78,17.14 | v2.54,17.14 1.91,17.78 1.91,20.95 2.01,21.06 SV7.2
  Bottom 0.406: v2.54,17.14 v17.78,17.14
N$34
  Top 0.406: U$3.2 15.41,40.39 R22.2 16.3,39.01 R23.2
N$35  (via drill 0.6)
  Top 0.406: IC2.6 IC2.7 23.5,73.11 23.5,71.75 25.4,69.85 v25.4,58.42 | R12.1 v48.9,59.05
  Bottom 0.406: v25.4,58.42 47.62,58.42 v48.9,59.05
N$36
  Top 0.406: R25.2 R26.2 12.47,24.5 R24.1 13.3,24.77 IC5.6
N$37  (via drill 0.6)
  Top 0.406: IC3.2 IC3.1 27.88,64.71 29.84,66.67 v29.84,69.22 | R31.2 34.51,71.97 33.66,71.12 v33.66,69.85
  Bottom 0.406: v33.66,69.85 30.48,69.85 v29.84,69.22
N$38  (via drill 0.6)
  Top 0.406: IC1.13 IC1.14 40.64,20.36 v40.64,22.86 | R26.1 10.62,21.77 v10.79,21.59
  Bottom 0.406: v10.79,21.59 12.06,21.59 13.34,22.86 v40.64,22.86
N$39  (via drill 0.6)
  Top 0.406: IC3.8 IC3.9 33.08,45.02 v34.29,43.81 | v40.01,43.81 40.01,45.09 40.64,45.72 v40.64,55.24 | v33.66,55.88 33.66,62.23 34.29,62.87 R33.2
  Bottom 0.406: v34.29,43.81 v40.01,43.81 | v40.64,55.24 34.29,55.24 v33.66,55.88
N$40  (via drill 0.6)
  Top 0.406: SV3.1 4.22,31.34 v4.45,31.11 | v42.55,33.02 v42.55,21.59
  Bottom 0.406: v42.55,21.59 48.49,21.59 SCALE.E | v4.45,31.11 22.23,31.11 24.13,33.02 v42.55,33.02
N$41  (via drill 0.6)
  Top 0.406: IC1.12 v42.55,17.78
  Bottom 0.406: v42.55,17.78 52.07,17.78 52.7,18.41 SCALE.S
N$42
  Top 0.406: IC2.13 IC2.14 28.61,81.74 R39.2
N$43  (via drill 0.6)
  Top 0.406: R19.1 6.17,29.39 v5.71,29.21 | v48.26,31.11 v48.26,10.16
  Bottom 0.406: v48.26,10.16 48.9,9.53 54.2,9.53 SV10.3 | v5.71,29.21 24.13,29.21 26.04,31.11 v48.26,31.11
N$44  (via drill 0.6)
  Top 0.406: IC3.7 IC3.6 26.04,46.99 v25.4,46.35 | R30.2 38.31,76.42 v39.37,77.47
  Bottom 0.406: v25.4,46.35 42.55,46.35 46.99,50.8 46.99,52.7 48.26,53.98 51.44,54.61 52.07,55.24 52.07,74.3 48.9,77.47 v39.37,77.47
N$45
  Top 0.406: IC4.10 R17.1 R31.1
N$46
  Top 0.406: IC4.9 38.73,69.22 37.47,70.48 37.47,73.44 R29.2 37.25,73.88 36.83,74.3 36.83,75.98 R30.1
N$47  (via drill 0.6)
  Top 0.406: IC4.8 40.78,71.83 R29.1 40.64,73.66 41.27,74.3 v41.27,79.38 v41.27,93.98 | v35.56,93.98 v35.56,105.41 | v43.81,105.41 43.81,102.54 XPAND.6 | R41.2 24.4,27.57 v26.04,28.57 | v38.1,29.84 38.1,45.72 38.73,46.35 v38.73,53.98 | v31.75,55.24 31.75,71.12 34.92,74.3 v34.92,79.38
  Bottom 0.406: v41.27,93.98 v35.56,93.98 | v35.56,105.41 v43.81,105.41 | v26.04,28.57 29.84,28.57 31.11,29.84 v38.1,29.84 | v34.92,79.38 v41.27,79.38 | v31.75,55.24 33.02,53.98 v38.73,53.98
N$48
  Top 0.406: IC3.13 IC3.14 33.08,53.4 34.29,54.61 37.05,54.61 R35.2
N$49
  Top 0.406: SV12.1 54.13,29.81 R45.1
N$50  (via drill 0.6)
  Top 0.406: v22.23,173.99 29.21,173.99 29.84,174.62 29.84,175.96 MODAMT.2 | SV8.1 7.54,128.19 8.89,129.54 v22.23,129.54
  Bottom 0.406: v22.23,129.54 v22.23,173.99
N$51
  Top 0.406: IC4.13 39.37,64.14 38.52,63.28 R32.2 R35.1
N$52  (via drill 0.6)
  Top 0.406: IC4.14 40.78,61.52 R32.1 41.27,60.96 42.55,59.69 v42.55,56.52 R42.2 | v43.18,81.28 v43.18,96.52 | v51.44,97.16 51.44,105.41 46.99,105.41 46.35,104.78 46.35,102.54 XPAND.4 | v48.9,57.15 49.53,57.78 52.7,57.78 v53.98,59.05
  Bottom 0.406: v53.98,59.05 53.98,74.93 47.62,81.28 v43.18,81.28 | v51.44,97.16 43.81,97.16 v43.18,96.52 | v48.9,57.15 43.18,57.15 v42.55,56.52
N$53  (via drill 0.6)
  Top 0.406: R24.2 15.29,23.15 IC5.7 15.88,23.25 v15.88,21.59 | R23.1 19,38.79 v20.95,40.64 | v27.94,40.64 27.94,26.67 26.67,24.77 v26.67,20.95
  Bottom 0.406: v20.95,40.64 v27.94,40.64 | v26.67,20.95 26.04,21.59 v15.88,21.59
N$54
  Top 0.406: IC4.12 37.68,65.41 R33.1 R34.1
N$55
  Top 0.406: IC4.5 48.9,67.94 | 48.9,67.94 49.95,67.94 R37.2 | R38.1 49.95,70.91 48.9,69.85 48.9,67.94
N$56  (via drill 0.6)
  Top 0.406: IC4.6 47.62,69.22 47.84,69.43 R36.2 47.84,76.42 49.53,78.11 v49.53,86.36 | v29.21,86.36 R39.1
  Bottom 0.406: v49.53,86.36 v29.21,86.36
N$57  (via drill 0.6)
  Top 0.406: v55.88,156.84 54.3,158.12 GAIN1.3
  Bottom 0.406: SV9.2 54.84,115.8 56.52,117.47 56.52,156.21 v55.88,156.84
N$58  (via drill 0.6)
  Top 0.406: IC4.7 45.99,72.87 R36.1 46.14,78.32 45.09,79.38 v45.09,95.25 | v53.34,97.16 v53.34,104.14
  Bottom 0.406: v53.34,97.16 52.07,95.89 45.72,95.89 v45.09,95.25 | v53.34,104.14 41.91,104.14 41.27,102.54 XPAND.8
N$59  (via drill 0.6)
  Top 0.406: IC5.9 23.35,24.77 R40.2 R41.1 25.24,25.87 v26.04,26.67 | v40.64,28.57 40.64,33.66 41.91,34.92 41.91,43.18 42.55,43.81 R42.1
  Bottom 0.406: v26.04,26.67 32.38,26.67 34.29,28.57 v40.64,28.57
N$60
  Top 0.406: R47.1 10.74,196.24 FREQ.1
N$61
  Top 0.406: IC5.8 21.59,23.5 22.86,22.23 23.46,22.23 R40.1 23.82,18.06 C22.-
N$62  (via drill 0.6)
  Top 0.406: IC1.3 33.02,17.78 31.11,15.88 v31.11,13.34 | SV1.4 4.65,15.84 R27.2
  Bottom 0.406: v31.11,13.34 5.61,13.34 SV1.4
N$63
  Top 0.406: R46.2 46.84,40.62 C21.+
N$64
  Top 0.406: SV12.4 51.4,40.51 R46.1
N$65
  Top 0.406: FREQ.2 13.72,192.75 R44.1
N$66
  Top 0.406: FREQ.3 16.22,192.88 R48.2
N$67  (via drill 0.6)
  Top 0.406: 35.4,20.16 IC1.1 | IC1.2 35.4,20.16 | 35.4,20.16 35.56,20.32 v35.56,26.67 | v44.45,26.67 v44.45,13.34
  Bottom 0.406: v35.56,26.67 v44.45,26.67 | v44.45,13.34 53.03,13.34 SV10.4
N$68  (via drill 0.6)
  Top 0.406: R6.2 2.98,47.81 2.54,48.26 2.54,50.76 R5.2 2.94,51.16 R50.2 2.98,53.87 R11.2 3.17,56.22 v3.17,58.42 | v19.68,58.42 19.68,60.33 19.53,60.48 R49.1 19.37,60.55 C6.1
  Bottom 0.406: v19.68,58.42 v3.17,58.42
N$69  (via drill 0.6)
  Top 0.406: SV1.1 6.85,4.78 R21.2 7.62,5.27 v7.62,6.99 | IC1.5 33.66,15.24 33.02,14.61 v33.02,7.62
  Bottom 0.406: v33.02,7.62 8.26,7.62 v7.62,6.99
N$70  (via drill 0.6)
  Top 0.406: C22.+ 27.76,16.97 28.57,17.78 v28.57,24.77 | v52.07,24.77 52.07,28.82 R45.2
  Bottom 0.406: v28.57,24.77 v52.07,24.77
N$71
  Top 0.406: POWER.10 POWER.9 16,98.3 17.14,97.16 18.41,97.16 19.68,95.89 19.68,94.83 R51.2
N$72
  Top 0.406: POWER.2 POWER.1 28.7,97.8 R9.2
N$73  (via drill 0.6)
  Top 0.406: SV7.4 4.27,27.48 1.91,29.84 v1.91,45.72 | v48.26,43.81 v48.26,49.53
  Bottom 0.406: v1.91,45.72 5.08,45.72 5.71,45.09 19.05,45.09 19.68,44.45 25.4,44.45 26.04,45.09 29.84,45.09 33.02,41.91 42.55,41.91 v48.26,43.81 | v48.26,49.53 51.44,49.53 52.7,50.8 52.7,51.97 MAXFREQ.S MAXFREQ.A
N$74
  Bottom 0.406: SV14.3 49.84,92.38 C7.-
N$75
  Bottom 0.406: AIN.P$3 8.56,125.98 SV2.4
N$76  (via drill 0.6)
  Top 0.406: v2.54,124.46 10.79,124.46 13.34,122.56 16.51,122.56 18.41,124.46 20.95,124.46 v21.59,125.09
  Bottom 0.406: v21.59,125.09 28.98,125.09 AIN2.P$3 | SV2.1 3.58,113.26 1.91,114.94 1.91,123.83 v2.54,124.46
N$77  (via drill 0.6)
  Top 0.406: SV4.4 13.77,151.97 v14.61,151.13
  Bottom 0.406: v14.61,151.13 14.61,143.97 MIN.P$3
N$78
  Top 0.406: SV4.1 7.19,144.98 8.89,146.69 26.87,146.69 VPEROCT.P$3
N$79  (via drill 0.6)
  Top 0.406: 31.83,131.37 v32.38,131.44 8.26,131.44 7.54,130.73 SV8.2
  Bottom 0.406: v32.38,131.44 32.38,175.48 MODAMT.3
N$80  (via drill 0.6)
  Top 0.406: SV8.3 3.25,133.27 v1.91,134.62 | v2.54,178.44 12.7,178.44 v13.34,179.07 | v13.34,186.06 13.34,190.67 R44.2
  Bottom 0.406: v1.91,134.62 1.91,177.8 v2.54,178.44 | v13.34,179.07 v13.34,186.06
N$81  (via drill 0.6)
  Top 0.406: v8.26,9.53 v8.26,19.05 6.99,19.68 4.37,19.68 SV7.1 | v42.55,9.53 42.55,15.24 IC1.10
  Bottom 0.406: v8.26,9.53 v42.55,9.53
N$82
  Top 0.406: SV11.1 47.57,141.81 BP.P$3
N$83  (via drill 0.6)
  Top 0.406: v45.72,131.44 51.44,131.44 v52.07,132.08
  Bottom 0.406: LP.P$3 45.31,131.04 v45.72,131.44 | v52.07,132.08 52.07,140.34 50.8,141.6 50.8,149.22 52.07,150.5 53.37,150.5 SV11.4
N$84  (via drill 0.6)
  Top 0.406: R20.1 v9.53,37.47 | v46.35,37.47 v46.35,4.45
  Bottom 0.406: v46.35,37.47 41.91,38.73 14.61,38.73 13.34,37.47 v9.53,37.47 | v46.35,4.45 53.57,4.45 SV10.1
N$85  (via drill 0.6)
  Top 0.406: v53.34,129.54 v25.4,129.54 | v26.04,157.48 16.48,157.48 GAIN.3
  Bottom 0.406: SV9.4 54.23,128.52 v53.34,129.54 | v26.04,157.48 26.04,142.24 27.3,140.97 27.3,136.53 25.4,134.62 v25.4,129.54
N$86
  Top 0.406: SV9.3 53.11,118.34 52.07,119.38 52.07,123.19 55.24,126.36 55.24,134.62 53.98,135.89 48.9,135.89 46.35,139.06 44.45,139.06 39.37,143.51 39.37,148.59 35.56,152.4 20.95,152.4 19.05,154.31 14.61,154.31 13.34,155.57 13.34,158.25 GAIN.2
N$87  (via drill 0.6)
  Top 0.406: v45.72,193.68 45.72,196.35 Q.2
  Bottom 0.406: SV13.3 51.21,200.43 50.8,200.03 50.8,194.31 50.16,193.68 v45.72,193.68
N$88  (via drill 0.6)
  Top 0.406: v37.47,156.21 44.45,156.21 45.44,157.2 GAIN1.2 | SV9.1 50.57,113.26 49.53,114.3 49.53,118.11 46.35,121.28 45.09,121.28 41.91,124.46 v36.83,124.46
  Bottom 0.406: v36.83,124.46 36.83,155.57 v37.47,156.21
N$89  (via drill 0.6)
  Top 0.406: v55.24,193.04 49.53,193.04 48.26,194.31 48.26,196.31 Q.3
  Bottom 0.406: SV13.4 55.47,202.97 56.52,201.93 56.52,194.31 v55.24,193.04
N$90  (via drill 0.6)
  Top 0.406: v6.99,173.99 v10.79,173.99 | v10.79,186.06 10.79,191.02 R47.2
  Bottom 0.406: SV8.4 4.47,139.72 6.99,142.24 6.99,162.56 6.35,163.19 6.35,173.35 v6.99,173.99 | v10.79,173.99 v10.79,186.06

### Text on the board
tPlace: MIN | VOCT | BP | AIN | AIN2 | LP